# Altium schematic sheet 07 RS485.SchDoc: RS485
size 420 x 297 mm; SheetNumber: 6; SheetTotal: 7
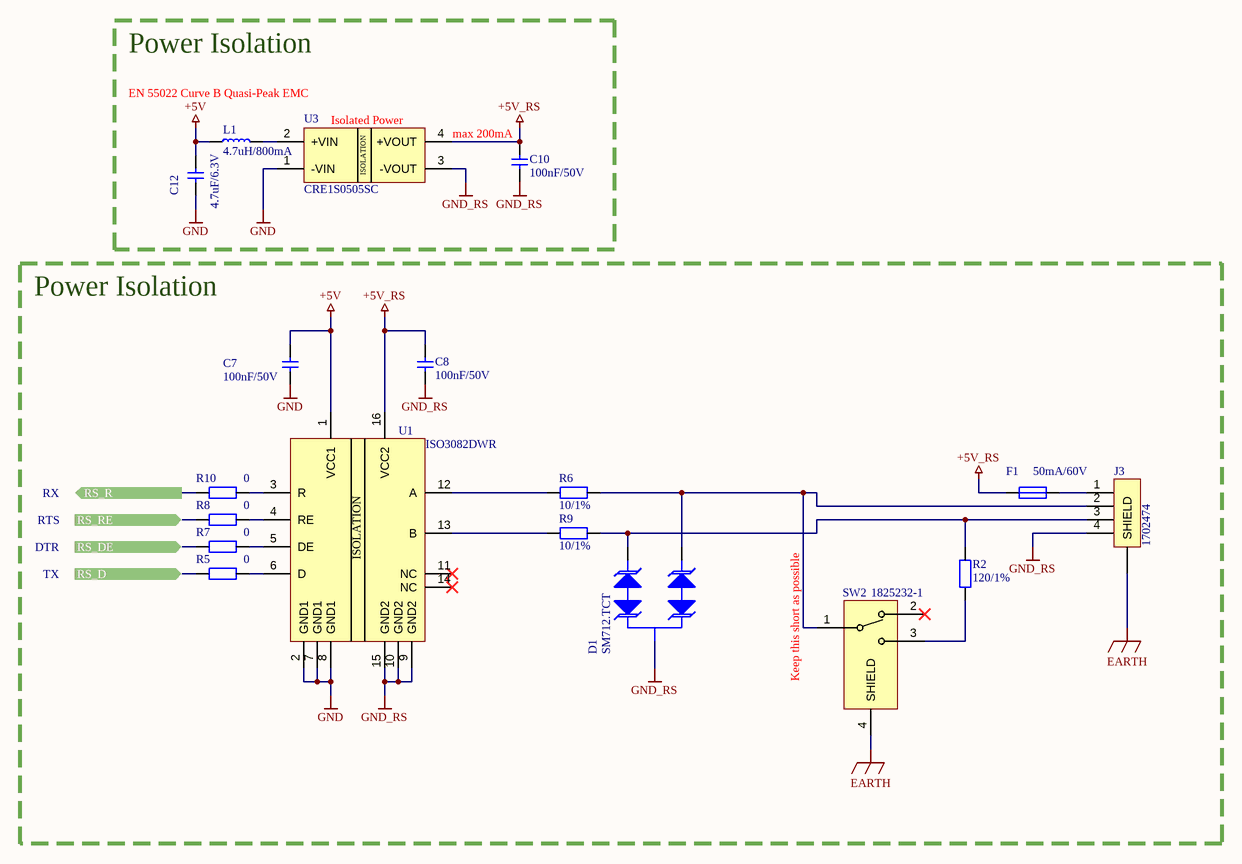
[diagram p0: 07 RS485.SchDoc]

## Parts
C7  100nF/50V  [CAPC1005X06N]
C8  100nF/50V  [CAPC1005X06N]
C10  100nF/50V  [CAPC1005X06N]
C12  4.7uF/6.3V  [CAPC1005X06N]
D1  SM712.TCT  [SOT95P237X110-3N]
F1  50mA/60V  [DIOC1005X04N]
J3  1702474  [1702474]
L1  4.7uH/800mA  [INDP3225X23N]
R2  120/1%  [RESC1005X04N]
R5  0  [RESC1005X04N]
R6  10/1%  [RESMELF3614N]
R7  0  [RESC1005X04N]
R8  0  [RESC1005X04N]
R9  10/1%  [RESMELF3614N]
R10  0  [RESC1005X04N]
SW2  1825232-1  [1825232-1]
U1  ISO3082DWR  [SOIC127P1030X265-16N]
U3  CRE1S0505SC  [CRE1S0505SC]

## Blocks framed on the sheet
Power Isolation: C10 C12 L1 U3
Power Isolation: C7 C8 D1 F1 J3 R2 R5-R10 SW2 U1

## Ports
RS_D (in), RS_DE (in), RS_R (out), RS_RE (in)

## Nets
+5V: C7.2 C12.2 L1.1 U1.1(VCC1)
+5V_RS: C8.2 C10.2 F1.1 U1.16(VCC2) U3.4(+VOUT)
EARTH: J3.SHIELD SW2.4(SHIELD)
GND: C7.1 C12.1 U1.2(GND1) U1.7(GND1) U1.8(GND1) U3.1(-VIN)
GND_RS: C8.1 C10.1 D1.3 J3.4 U1.9(GND2) U1.10(GND2) U1.15(GND2) U3.3(-VOUT)
RS_D: R5.1 ; port RS_D
RS_DE: R7.1 ; port RS_DE
RS_R: R10.1 ; port RS_R
RS_RE: R8.1 ; port RS_RE
NetD1_1: D1.1 J3.3 R2.2 R9.2
NetD1_2: D1.2 J3.2 R6.2 SW2.1
NetF1_2: F1.2 J3.1
NetL1_2: L1.2 U3.2(+VIN)
NetR2_1: R2.1 SW2.3
NetR5_2: R5.2 U1.6(D)
NetR6_1: R6.1 U1.12(A)
NetR7_2: R7.2 U1.5(DE)
NetR8_2: R8.2 U1.4(RE)
NetR9_1: R9.1 U1.13(B)
NetR10_2: R10.2 U1.3(R)

Not connected (* = marked no-connect by the designer): SW2 2*; U1 11(NC)* 14(NC)*

## Notes on the sheet
- EN 55022 Curve B Quasi-Peak EMC
- (near U3) Isolated Power
- max 200mA
- RX
- RTS
- DTR
- TX
- (near SW2) Keep this short as possible
- Title
- Project
- Size
- Date
- Revision
- A3
- Designed By
- (in symbol CRE1S0505SC) ISOLATION
- (in symbol ISO3082DWR) ISOLATION

## Library data of the parts
C7 C8 C10 = GCM155R71H104KE02J: 0.1 µF ±10% 50V Ceramic Capacitor X7R 0402 (1005 Metric); manufacturer: Murata Electronics; mfr_part_number: GCM155R71H104KE02J; assembler_number: GCM155R71H104KE02J; datasheet: https://search.murata.co.jp/Ceramy/image/img/A01X/G101/ENG/GCM155R71H104KE02-01.pdf
C12 = JMK105BBJ475MVHF: 4.7 µF ±20% 6.3V Ceramic Capacitor X5R 0402 (1005 Metric); manufacturer: Taiyo Yuden; mfr_part_number: JMK105BBJ475MVHF; assembler_number: JMK105BBJ475MVHF; datasheet: https://media.digikey.com/pdf/Data%20Sheets/Taiyo%20Yuden%20PDFs%20URL%20links/JMK105BBJ475MVHF_SS.pdf
D1 = SM712.TCT: 26V, 12V Clamp 17A (8/20µs) Ipp Tvs Diode Surface Mount SOT-23-3; manufacturer: Semtech Corporation; mfr_part_number: SM712.TCT; assembler_number: SM712.TCT; datasheet: https://semtech.my.salesforce.com/sfc/p/#E0000000JelG/a/440000001MKW/f6pBKheIN2CeR0DxWdS3THuJ7nh4aKYltSzghsLP5iw
F1 = 0ZCJ0005FF2E: Polymeric PTC Resettable Fuse 60V 50 mA Ih Surface Mount 1206 (3216 Metric), Concave; manufacturer: Bel Fuse Inc.; mfr_part_number: 0ZCJ0005FF2E; assembler_number: 0ZCJ0005FF2E; datasheet: https://www.belfuse.com/resources/datasheets/circuitprotection/ds-cp-0zcj-series.pdf
J3 = 1702474: 4 Position Wire to Board Terminal Block Horizontal with Board 0.098" (2.50mm) Surface Mount; manufacturer: Phoenix Contact; mfr_part_number: 1702474; assembler_number: 1702474; datasheet: https://media.digikey.com/PDF/Data%20Sheets/Phoenix%20Contact%20PDFs/1702474.pdf
L1 = 82472C: 4.7 µH Unshielded Wirewound Inductor 800 mA 190mOhm Max 1210 (3225 Metric); manufacturer: Murata Power Solutions Inc.; mfr_part_number: 82472C; assembler_number: 82472C; datasheet: https://search.murata.co.jp/Ceramy/image/img/P02A/kmp_8200c.pdf
R2 = ERJ-2RKF1200X: 120 Ohms ±1% 0.1W, 1/10W Chip Resistor 0402 (1005 Metric) Automotive AEC-Q200 Thick Film; manufacturer: Panasonic Electronic Components; mfr_part_number: ERJ-2RKF1200X; assembler_number: ERJ-2RKF1200X; datasheet: https://industrial.panasonic.com/cdbs/www-data/pdf/RDA0000/AOA0000C304.pdf
R5 R7 R8 R10 = ERJ-2GE0R00X: 0 Ohms Jumper Chip Resistor 0402 (1005 Metric) Automotive AEC-Q200 Thick Film; manufacturer: Panasonic Electronic Components; mfr_part_number: ERJ-2GE0R00X; assembler_number: ERJ-2GE0R00X; datasheet: https://industrial.panasonic.com/ww/products/pt/general-purpose-chip-resistors/models/ERJ2GE0R00X
R6 R9 = SMM02040C1009FB300: 10 Ohms ±1% 0.25W, 1/4W Chip Resistor MELF, 0204 Anti-Sulfur, Automotive AEC-Q200, Pulse Withstanding Thin Film; manufacturer: Vishay Beyschlag/Draloric/BC Components; mfr_part_number: SMM02040C1009FB300; assembler_number: SMM02040C1009FB300; datasheet: https://www.vishay.com/docs/20004/smm0204.pdf
SW2 = 1825232-1: Slide Switch SPDT Through Hole, Right Angle; manufacturer: C&K; mfr_part_number: JS202011JAQN; assembler_number: JS202011JAQN; datasheet: https://www.ckswitches.com/media/1422/js.pdf
U1 = ISO3082DWR: 2/2 Transceiver, Isolated Half RS422, RS485 16-SOIC; manufacturer: Texas Instruments; mfr_part_number: ISO3082DWR; assembler_number: ISO3082DWR; datasheet: https://www.ti.com/general/docs/suppproductinfo.tsp?distId=10&gotoUrl=https%3A%2F%2Fwww.ti.com%2Flit%2Fgpn%2Fiso3082
U3 = CRE1S0505SC: Isolated Module DC DC Converter 1 Output 5V 200mA 4.5V - 5.5V Input; manufacturer: Murata Power Solutions Inc.; mfr_part_number: CRE1S0505SC; assembler_number: CRE1S0505SC; datasheet: https://www.murata.com/products/productdata/8807029407774/kdc-cre1.pdf